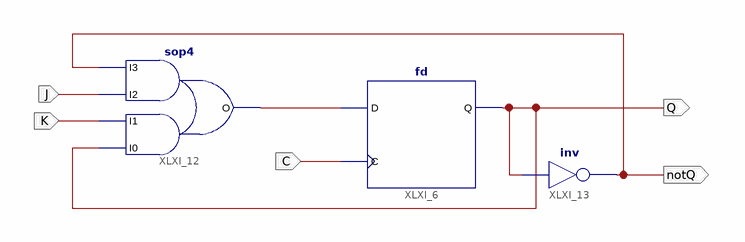
[diagram p0: schematic sheet 1]
// Xilinx ISE schematic scheme.sch (virtex5) as structural Verilog: 3 symbols, 5 ports
module scheme (
  input  J,
  input  K,
  input  C,
  output Q,
  output notQ
);

  wire XLXN_1;

  fd XLXI_6 (.C(C), .D(XLXN_1), .Q(Q));
  sop4 XLXI_12 (.I0(Q), .I1(K), .I2(J), .I3(notQ), .O(XLXN_1));
  not XLXI_13 (notQ, Q);
endmodule
